# Altium schematic sheet PC104 Header.SchDoc
size B
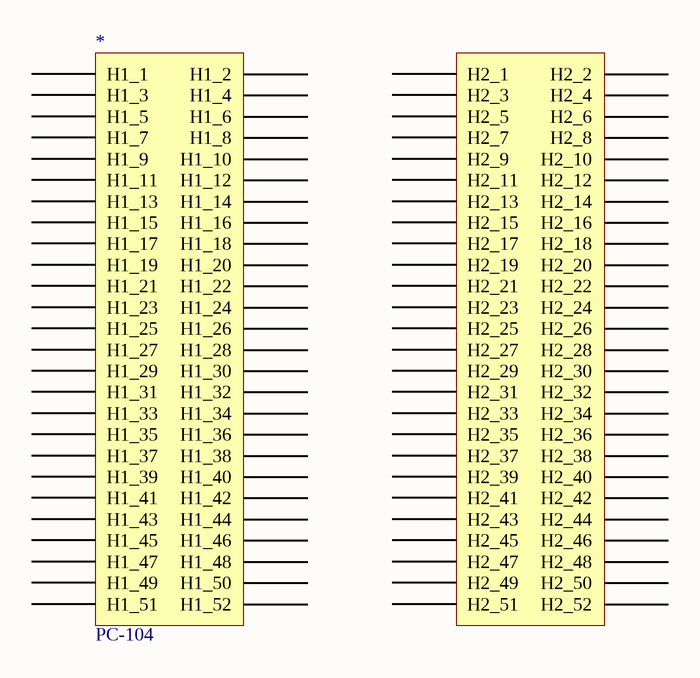
[diagram p0: PC104 Header.SchDoc]

## Parts
*  PC-104  [PC-104FOOTPRINT]

## Nets

Not connected (* = marked no-connect by the designer): * H1_1 H1_2 H1_3 H1_4 H1_5 H1_6 H1_7 H1_8 H1_9 H1_10 H1_11 H1_12 H1_13 H1_14 H1_15 H1_16 H1_17 H1_18 H1_19 H1_20 H1_21 H1_22 H1_23 H1_24 H1_25 H1_26 H1_27 H1_28 H1_29 H1_30 H1_31 H1_32 H1_33 H1_34 H1_35 H1_36 H1_37 H1_38 H1_39 H1_40 H1_41 H1_42 H1_43 H1_44 H1_45 H1_46 H1_47 H1_48 H1_49 H1_50 H1_51 H1_52 H2_1 H2_2 H2_3 H2_4 H2_5 H2_6 H2_7 H2_8 H2_9 H2_10 H2_11 H2_12 H2_13 H2_14 H2_15 H2_16 H2_17 H2_18 H2_19 H2_20 H2_21 H2_22 H2_23 H2_24 H2_25 H2_26 H2_27 H2_28 H2_29 H2_30 H2_31 H2_32 H2_33 H2_34 H2_35 H2_36 H2_37 H2_38 H2_39 H2_40 H2_41 H2_42 H2_43 H2_44 H2_45 H2_46 H2_47 H2_48 H2_49 H2_50 H2_51 H2_52